# EAGLE schematic Atmega32U4 Basic Schematic (EAGLE 7.6.0)
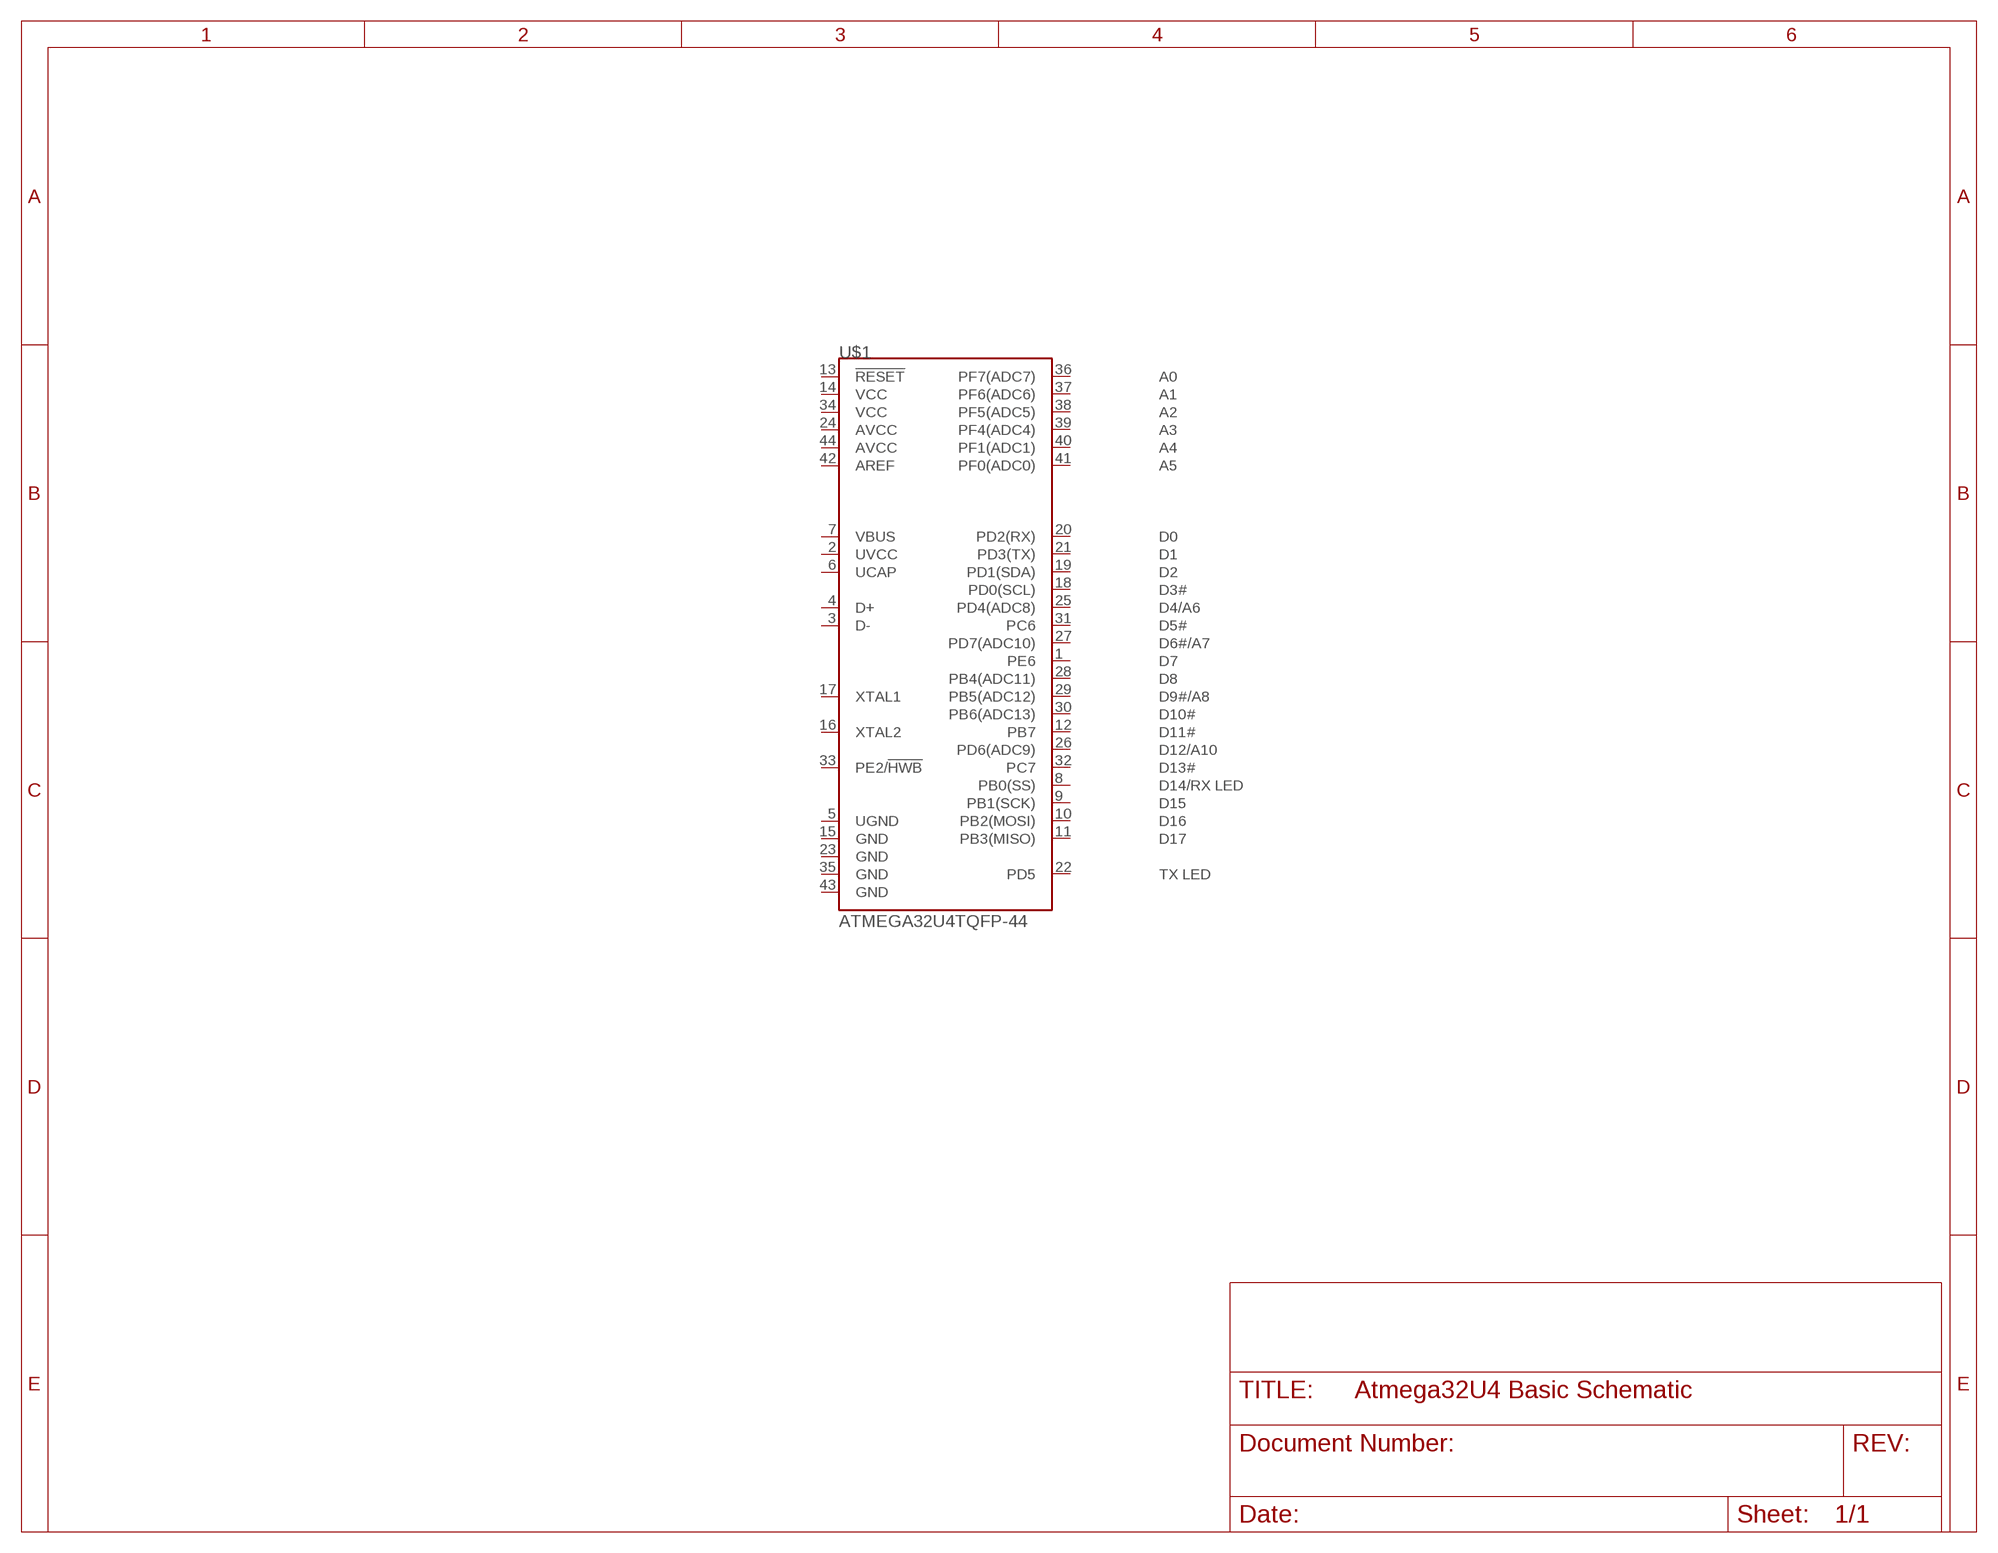
[diagram p0: schematic, sheet 1]

## Parts
U$1  ATMEGA32U4TQFP-44  [TQFP44]
Unconnected: U$1.1(PE6) U$1.2(UVCC) U$1.3(D-) U$1.4(D+) U$1.5(UGND) U$1.6(UCAP) U$1.7(VBUS) U$1.8(PB0(SS)) U$1.9(PB1(SCK)) U$1.10(PB2(MOSI)) U$1.11(PB3(MISO)) U$1.12(PB7) U$1.13(!RESET) U$1.14(VCC) U$1.15(GND) U$1.16(XTAL2) U$1.17(XTAL1) U$1.18(PD0(SCL)) U$1.19(PD1(SDA)) U$1.20(PD2(RX)) U$1.21(PD3(TX)) U$1.22(PD5) U$1.23(GND) U$1.24(AVCC) U$1.25(PD4(ADC8)) U$1.26(PD6(ADC9)) U$1.27(PD7(ADC10)) U$1.28(PB4(ADC11)) U$1.29(PB5(ADC12)) U$1.30(PB6(ADC13)) U$1.31(PC6) U$1.32(PC7) U$1.33(PE2/!HWB) U$1.34(VCC) U$1.35(GND) U$1.36(PF7(ADC7)) U$1.37(PF6(ADC6)) U$1.38(PF5(ADC5)) U$1.39(PF4(ADC4)) U$1.40(PF1(ADC1)) U$1.41(PF0(ADC0)) U$1.42(AREF) U$1.43(GND) U$1.44(AVCC)

## Library data of the parts
U$1 = SparkFun-DigitalIC:ATMEGA32U4: Atmel 44-pin 8-bit Microcontroller with 32KBytes of ISP Flash and USB Controller